# EasyEDA schematic 1-Schematic_Nakuja Remix 3.json
TITLE: Sheet_1; REV: 1.0; Date: 2022-04-21; Sheet: 1/1; Drawn By: Rodney Osodo; Company: Your Company
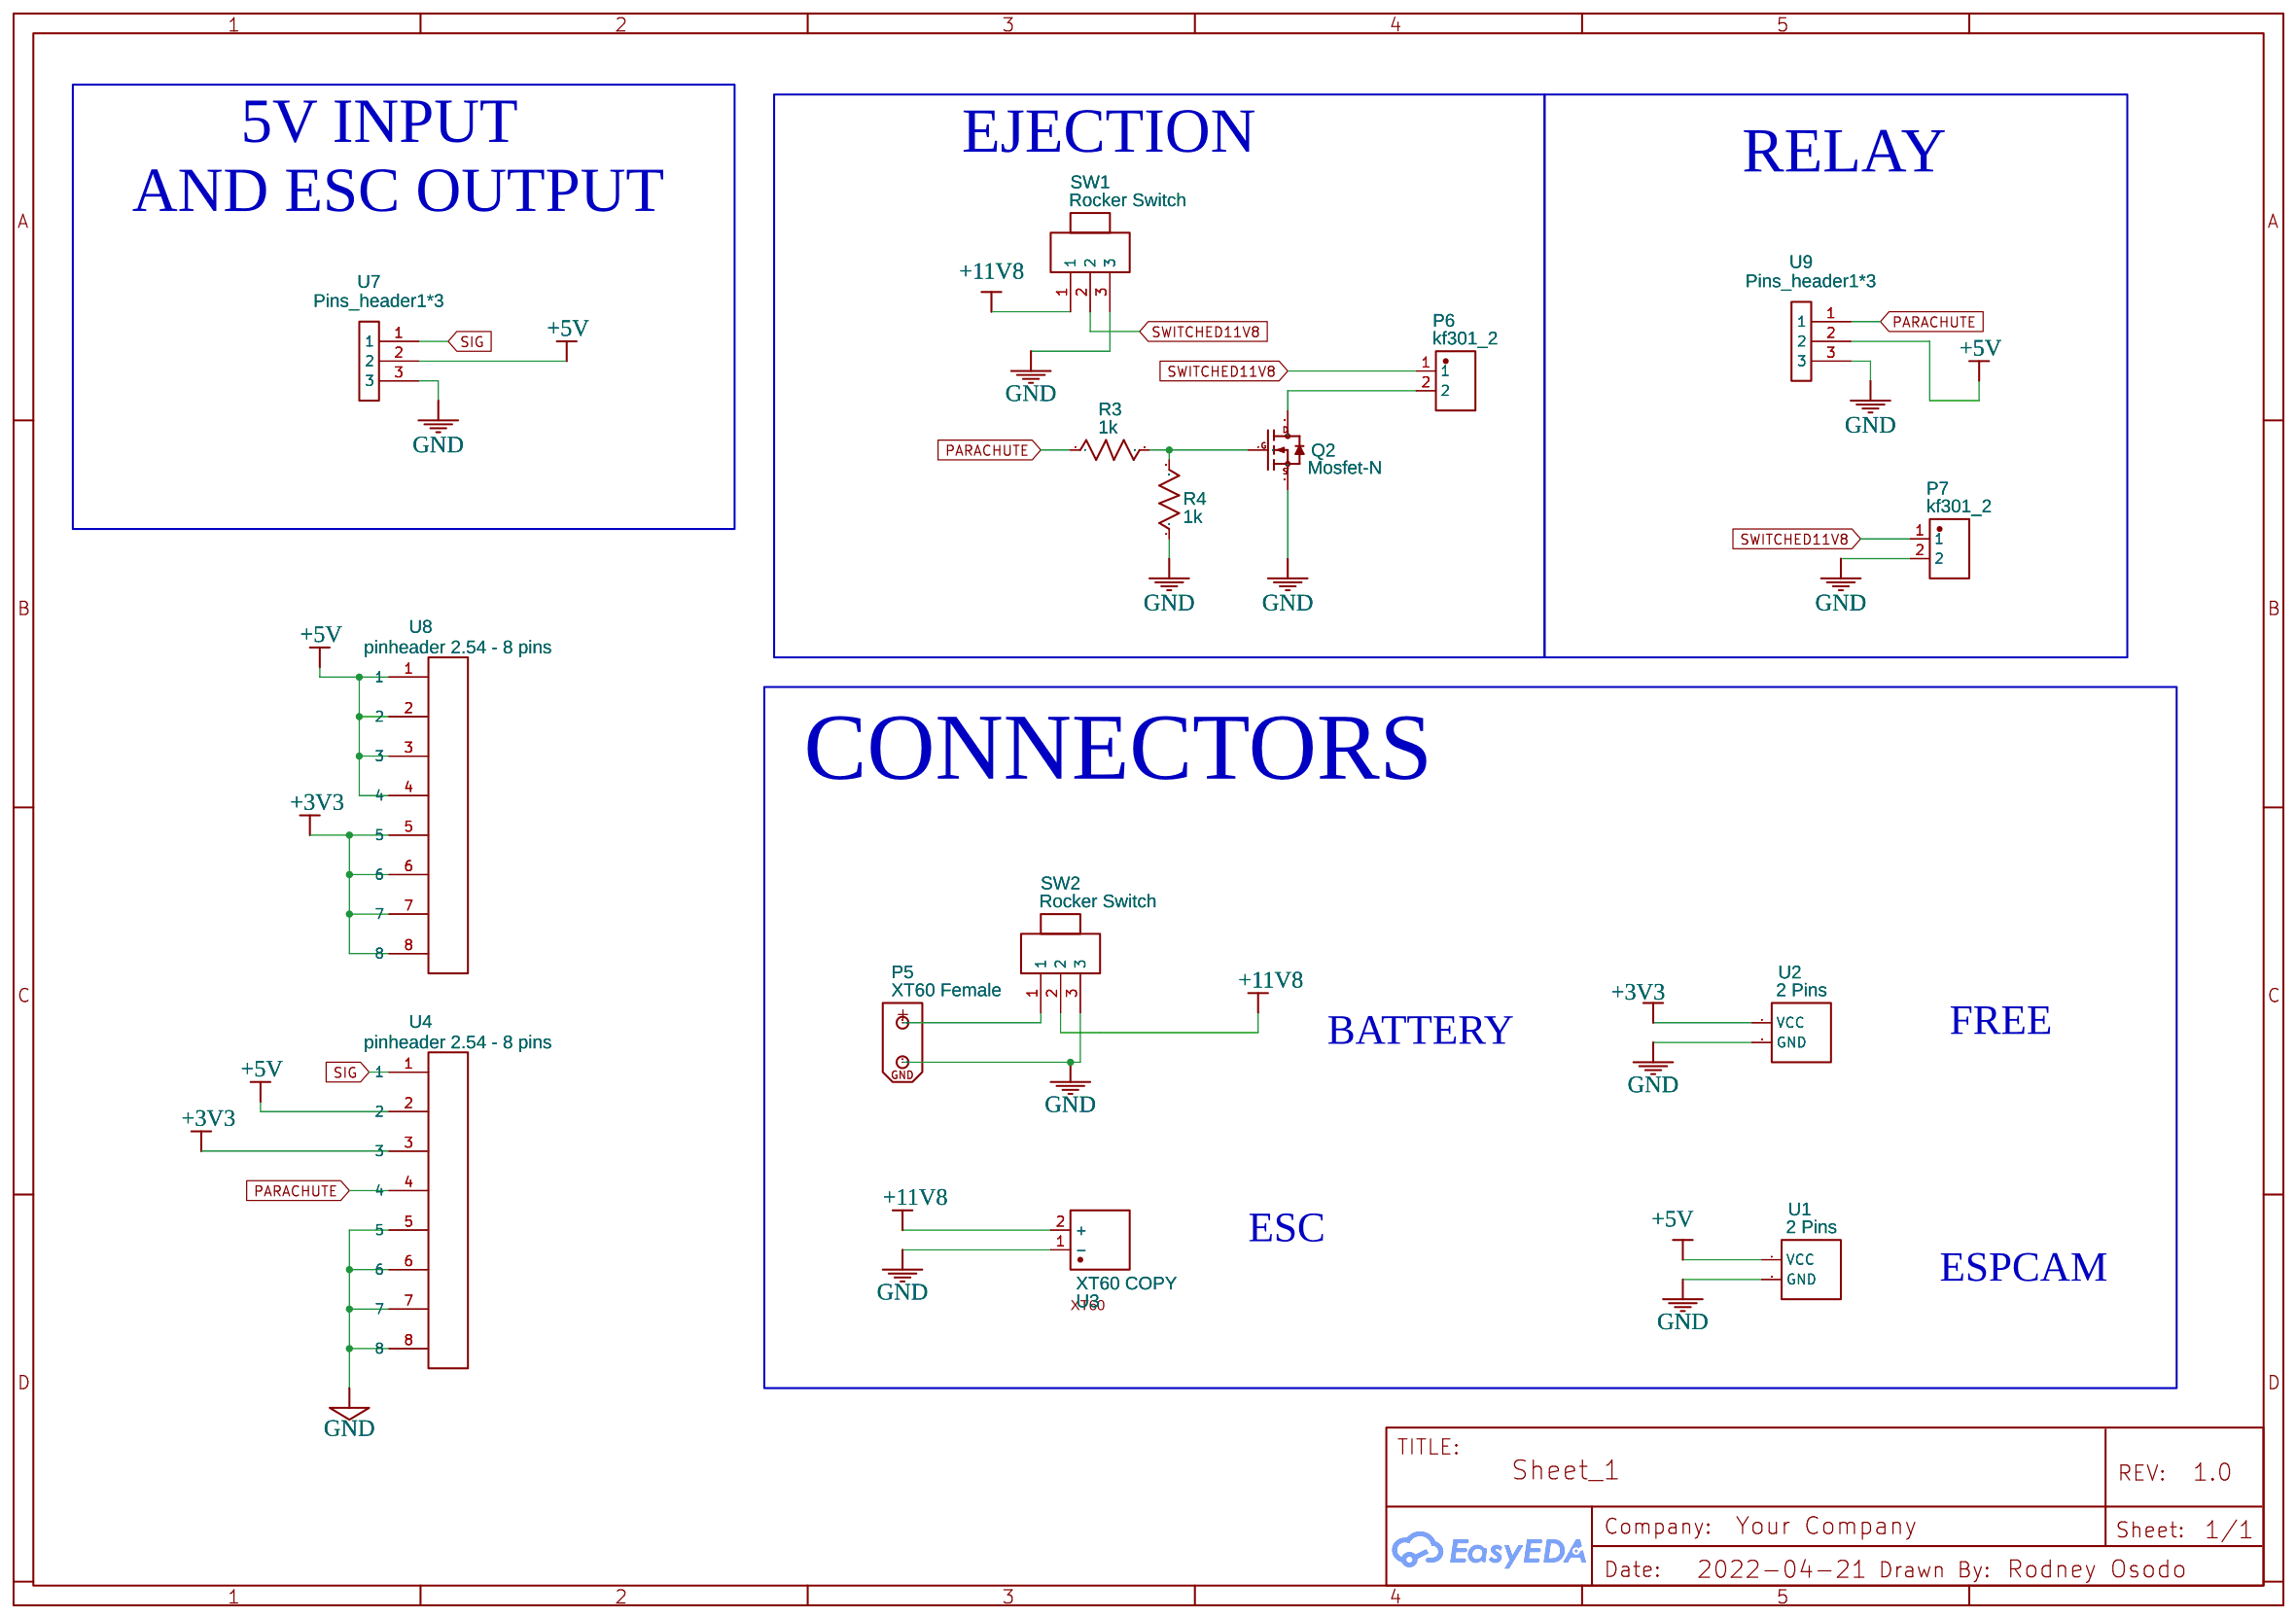
[diagram p0: schematic sheet]

## Parts
P5  XT60 Female  [XT60-F]
P6  kf301_2  [KF301_2P]
P7  kf301_2  [KF301_2P]
Q2  Mosfet-N  [DC-MOSFET-TO-220]
R3  1k  [R_AXIAL-0.6]
R4  1k  [R_AXIAL-0.6]
SW1  Rocker Switch  [ROCKER SWITCH TH]
SW2  Rocker Switch  [ROCKER SWITCH TH]
U1  2 Pins  [2 PINS HEADER]
U2  2 Pins  [2 PINS HEADER]
U3  XT60 COPY  [XT60]
U4  pinheader 2.54 - 8 pins  [PINHEADER 2.54 - 8 PINS]
U7  Pins_header1*3  [PINS_HEADER1*3]
U8  pinheader 2.54 - 8 pins  [PINHEADER 2.54 - 8 PINS]
U9  Pins_header1*3  [PINS_HEADER1*3]

## Library data of the parts
P5 = XT60 Female: Manufacturer: Changzhou Amass Elec; Contributor: rifanoz
P6 P7 = kf301_2: Manufacturer: BOOMELE; image: //image.lceda.cn/szlcsc/C33435.jpg; Supplier Part: C33435; Contributor: rusrobot
Q2 = Mosfet-N: Contributor: dina
R3 R4 = R_AXIAL-0.6_US: Contributor: LCEDA_Lib
SW1 SW2 = Rocker Switch: Mounted: Yes
U1 U2 = 2 Pins: Contributor: Uzain Yaseen
U3 = XT60 COPY: Contributor: Mitian
U4 U8 = pinheader 2.54 - 8 pins: Contributor: pramodsreelakam
U7 U9 = Pins_header1*3: Contributor: Nattanan

## Nets
+3V3: U2.1(VCC) U4.3 U8.5 U8.6 U8.7 U8.8
+5V: U1.1(VCC) U4.2 U7.2 U8.1 U8.2 U8.3 U8.4 U9.2
+11V8: SW1.1 SW2.2 U3.2(+)
GND: P5.1 P7.2 Q2.3(S) R4.1 SW1.3 SW2.3 U1.2(GND) U2.2(GND) U3.1(-) U4.5 U4.6 U4.7 U4.8 U7.3 U9.3
PARACHUTE: R3.1 U4.4 U9.1
SIG: U4.1 U7.1
SWITCHED11V8: P6.1 P7.1 SW1.2
Net-(P5-2): P5.2 SW2.1
Net-(P6-2): P6.2 Q2.2(D)
Net-(Q2-1): Q2.1(G) R3.2 R4.2

## Notes on the sheet
- 5V INPUT
- EJECTION
- RELAY
- AND ESC OUTPUT
- CONNECTORS
- BATTERY
- FREE
- ESC
- ESPCAM
